# EAGLE schematic BlockBox (EAGLE 9.5.2)

## Sheet 1 of 4: Battery
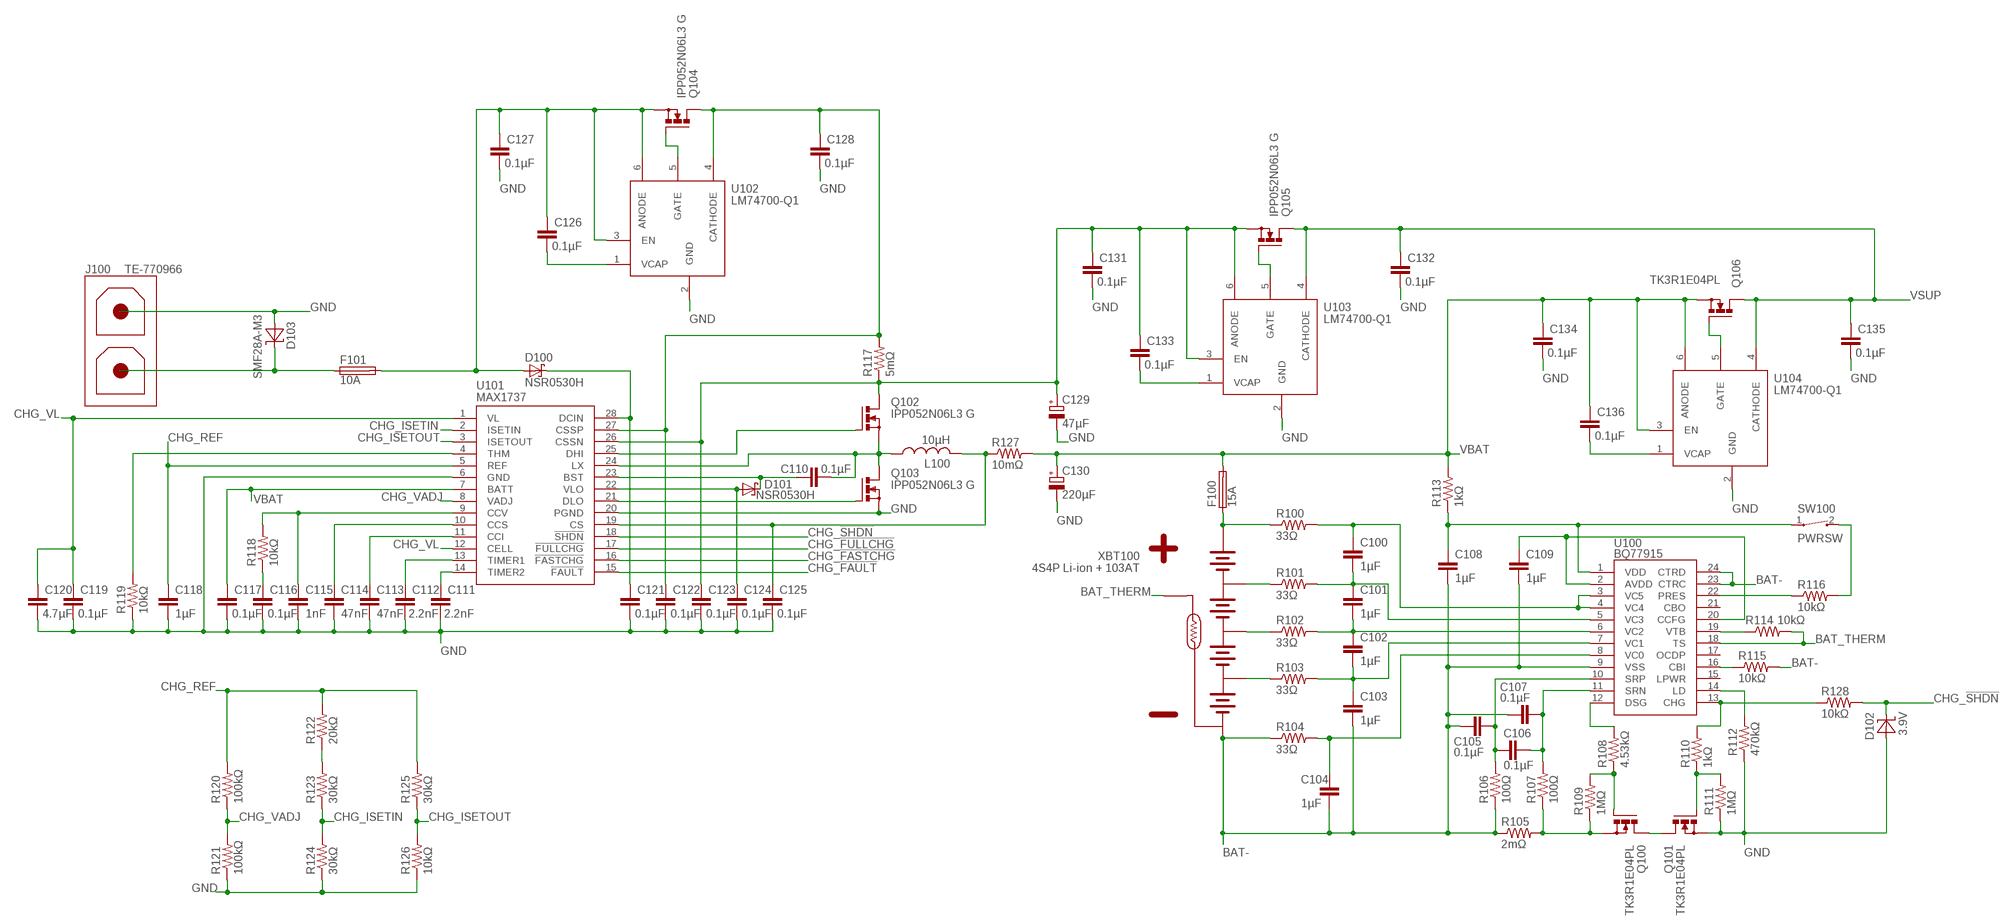
[diagram p0: schematic, sheet 1]

### Parts
C100  1µF  C-EUC0603  [C0603]
C101  1µF  C-EUC0603  [C0603]
C102  1µF  C-EUC0603  [C0603]
C103  1µF  C-EUC0603  [C0603]
C104  1µF  C-EUC0603  [C0603]
C105  0.1µF  C-EUC0805  [C0805]
C106  0.1µF  C-EUC0805  [C0805]
C107  0.1µF  C-EUC0805  [C0805]
C108  1µF  C-EUC0603  [C0603]
C109  1µF  C-EUC0603  [C0603]
C110  0.1µF  C-EUC0805  [C0805]
C111  2.2nF  C-EUC0603  [C0603]
C112  2.2nF  C-EUC0603  [C0603]
C113  47nF  C-EUC0603  [C0603]
C114  47nF  C-EUC0603  [C0603]
C115  1nF  C-EUC0603  [C0603]
C116  0.1µF  C-EUC0805  [C0805]
C117  0.1µF  C-EUC0805  [C0805]
C118  1µF  C-EUC0603  [C0603]
C119  0.1µF  C-EUC0805  [C0805]
C120  4.7µF  C-EUC0805  [C0805]
C121  0.1µF  C-EUC0805  [C0805]
C122  0.1µF  C-EUC0805  [C0805]
C123  0.1µF  C-EUC0805  [C0805]
C124  0.1µF  C-EUC0805  [C0805]
C125  0.1µF  C-EUC0805  [C0805]
C126  0.1µF  C-EUC0805  [C0805]
C127  0.1µF  C-EUC0805  [C0805]
C128  0.1µF  C-EUC0805  [C0805]
C129  47µF  CPOL-EUE2.5-6  [E2,5-6]
C130  220µF  CPOL-EUE3.5-8  [E3,5-8]
C131  0.1µF  C-EUC0805  [C0805]
C132  0.1µF  C-EUC0805  [C0805]
C133  0.1µF  C-EUC0805  [C0805]
C134  0.1µF  C-EUC0805  [C0805]
C135  0.1µF  C-EUC0805  [C0805]
C136  0.1µF  C-EUC0805  [C0805]
D100  NSR0530H  SOD323-SCHOTTKY  [SOD323]
D101  NSR0530H  SOD323-SCHOTTKY  [SOD323]
D102  3.9V  SOD323-ZENER  [SOD323]
D103  SMF28A-M3  DO-219AB-ZENER  [DO-219AB]
F100  15A  2410-FUSE  [F2410]
F101  10A  2410-FUSE  [F2410]
J100  TE-770966  [TE-770966]
L100  10µH  PM5022  [PM5022]
Q100  TK3R1E04PL  TO220BV-N-MOSFET  [TO220BV]
Q101  TK3R1E04PL  TO220BV-N-MOSFET  [TO220BV]
Q102  IPP052N06L3 G  TO220BV-N-MOSFET  [TO220BV]
Q103  IPP052N06L3 G  TO220BV-N-MOSFET  [TO220BV]
Q104  IPP052N06L3 G  TO220BV-N-MOSFET  [TO220BV]
Q105  IPP052N06L3 G  TO220BV-N-MOSFET  [TO220BV]
Q106  TK3R1E04PL  TO220BV-N-MOSFET  [TO220BV]
R100  33Ω  R-US_R0603  [R0603]
R101  33Ω  R-US_R0603  [R0603]
R102  33Ω  R-US_R0603  [R0603]
R103  33Ω  R-US_R0603  [R0603]
R104  33Ω  R-US_R0603  [R0603]
R105  2mΩ  R-US_R2512  [R2512]
R106  100Ω  R-US_R0603  [R0603]
R107  100Ω  R-US_R0603  [R0603]
R108  4.53kΩ  R-US_R0603  [R0603]
R109  1MΩ  R-US_R0603  [R0603]
R110  1kΩ  R-US_R0805  [R0805]
R111  1MΩ  R-US_R0603  [R0603]
R112  470kΩ  R-US_R0603  [R0603]
R113  1kΩ  R-US_R0805  [R0805]
R114  10kΩ  R-US_R0805  [R0805]
R115  10kΩ  R-US_R0805  [R0805]
R116  10kΩ  R-US_R0805  [R0805]
R117  5mΩ  R-US_R1206  [R1206]
R118  10kΩ  R-US_R0805  [R0805]
R119  10kΩ  R-US_R0805  [R0805]
R120  100kΩ  R-US_R0805  [R0805]
R121  100kΩ  R-US_R0805  [R0805]
R122  20kΩ  R-US_R0603  [R0603]
R123  30kΩ  R-US_R0603  [R0603]
R124  30kΩ  R-US_R0603  [R0603]
R125  30kΩ  R-US_R0603  [R0603]
R126  10kΩ  R-US_R0805  [R0805]
R127  10mΩ  R-US_R1206  [R1206]
R128  10kΩ  R-US_R0805  [R0805]
SW100  PWRSW  WIRED-SWITCH-NO  [WIRE-2P-SIMPLE]
U100  BQ77915  [TSSOP24]
U101  MAX1737  [QSOP28]
U102  LM74700-Q1  [SOT23-6L]
U103  LM74700-Q1  [SOT23-6L]
U104  LM74700-Q1  [SOT23-6L]
XBT100  4S4P Li-ion + 103AT  LI-ION-PACK-CONN  [TE-770970]

### Nets
BAT-: C103.2 C104.2 C105.1 C107.1 C108.2 C109.2 R104.1 R105.1 R106.1 R115.2 U100.9(VSS) U100.23(CTRC) U100.24(CTRD) XBT100.5(-) XBT100.6(-)
BAT-_INT1: Q100.S R105.2 R107.1 R109.1
BAT-_INT2: Q100.D Q101.D
BAT_AVDD: C109.1 U100.2(AVDD) U100.20(CCFG)
BAT_BAL0: C104.1 R104.2 U100.8(VC0)
BAT_BAL1: C102.2 C103.1 R103.2 U100.7(VC1)
BAT_BAL2: C101.2 C102.1 R102.2 U100.6(VC2)
BAT_BAL3: C100.2 C101.1 R101.2 U100.5(VC3)
BAT_BAL4: C100.1 R100.2 U100.3(VC5) U100.4(VC4)
BAT_CBI: R115.1 U100.16(CBI)
BAT_CHG_CTL: R110.2 R128.1 U100.13(CHG)
BAT_CHG_GATE: Q101.G R110.1 R111.2
BAT_CSN: C106.2 C107.2 R107.2 U100.11(SRN)
BAT_CSP: C105.2 C106.1 R106.2 U100.10(SRP)
BAT_DSG_CTL: R108.2 U100.12(DSG)
BAT_DSG_GATE: Q100.G R108.1 R109.2
BAT_INT1: R103.1 XBT100.4(BAL1)
BAT_INT2: R102.1 XBT100.3(BAL2)
BAT_INT3: R101.1 XBT100.7(BAL3)
BAT_LD: R112.2 U100.14(LD)
BAT_PRES: R116.1 U100.22(PRES)
BAT_PRES_SW: R116.2 SW100.2
BAT_THERM: R114.2 U100.18(TS) XBT100.8(THERM1)
BAT_VDD: C108.1 R113.1 SW100.1 U100.1(VDD)
BAT_VTB: R114.1 U100.19(VTB)
CHG_!FASTCHG: U101.16(!FASTCHG) ; also sheet 4
CHG_!FAULT: U101.15(!FAULT) ; also sheet 4
CHG_!FULLCHG: U101.17(!FULLCHG) ; also sheet 4
CHG_!SHDN: D102.1(C) R128.2 U101.18(!SHDN)
CHG_BST: C110.1 D101.1(C) U101.23(BST)
CHG_CCI: C113.1 U101.11(CCI)
CHG_CCS: C114.1 U101.10(CCS)
CHG_CCV: C115.1 R118.2 U101.9(CCV)
CHG_CCV_FILT: C116.1 R118.1
CHG_CS: C125.1 L100.2 R127.1 U101.19(CS)
CHG_CSSN: C123.1 C129.+ C131.1 C133.1 Q102.D Q105.S R117.1 U101.26(CSSN) U103.3(EN) U103.6(ANODE)
CHG_CSSP: C122.1 C128.1 Q104.D R117.2 U101.27(CSSP) U102.4(CATHODE)
CHG_DCIN: C121.1 D100.1(C) U101.28(DCIN)
CHG_DHI: Q102.G U101.25(DHI)
CHG_DLO: Q103.G U101.21(DLO)
CHG_ISETIN: R123.1 R124.2 U101.2(ISETIN)
CHG_ISETIN_INT: R122.1 R123.2
CHG_ISETOUT: R125.1 R126.2 U101.3(ISETOUT)
CHG_LX: C110.2 L100.1 Q102.S Q103.D U101.24(LX)
CHG_REF: C118.1 R120.2 R122.2 R125.2 U101.5(REF)
CHG_THM: R119.2 U101.4(THM)
CHG_TIMER1: C112.1 U101.13(TIMER1)
CHG_TIMER2: C111.1 U101.14(TIMER2)
CHG_VADJ: R120.1 R121.2 U101.8(VADJ)
CHG_VL: C119.1 C120.1 U101.1(VL) U101.12(CELL)
CHG_VLO: C124.1 D101.2(A) U101.22(VLO)
GND: C111.2 C112.2 C113.2 C114.2 C115.2 C116.2 C117.2 C118.2 C119.2 C120.2 C121.2 C122.2 C123.2 C124.2 C125.2 C127.2 C128.2 C129.- C130.- C131.2 C132.2 C134.2 C135.2 D102.2(A) D103.A J100.2 Q101.S Q103.S R111.1 R112.1 R119.1 R121.1 R124.1 R126.1 U101.6(GND) U101.20(PGND) U102.2(GND) U103.2(GND) U104.2(GND) ; also sheet 2,3,4
VBAT: C117.1 C130.+ C134.1 C136.1 F100.2 Q106.S R113.2 R127.2 U101.7(BATT) U104.3(EN) U104.6(ANODE) ; also sheet 4
VBAT_PREFUSE: F100.1 R100.1 XBT100.1(+) XBT100.2(+)
VIN_EXT: D103.K(C) F101.1 J100.1
VIN_EXT_FUSED: C126.1 C127.1 D100.2(A) F101.2 Q104.S U102.3(EN) U102.6(ANODE)
VIN_ID_GATE: Q104.G U102.5(GATE)
VIN_ID_VCAP: C126.2 U102.1(VCAP)
VSUP: C132.1 C135.1 Q105.D Q106.D U103.4(CATHODE) U104.4(CATHODE) ; also sheet 2
VSUP_ID1_GATE: Q105.G U103.5(GATE)
VSUP_ID1_VCAP: C133.2 U103.1(VCAP)
VSUP_ID2_GATE: Q106.G U104.5(GATE)
VSUP_ID2_VCAP: C136.2 U104.1(VCAP)
Unconnected: U100.15(LPWR) U100.17(OCDP) U100.21(CBO)

## Sheet 2 of 4: Power conversion
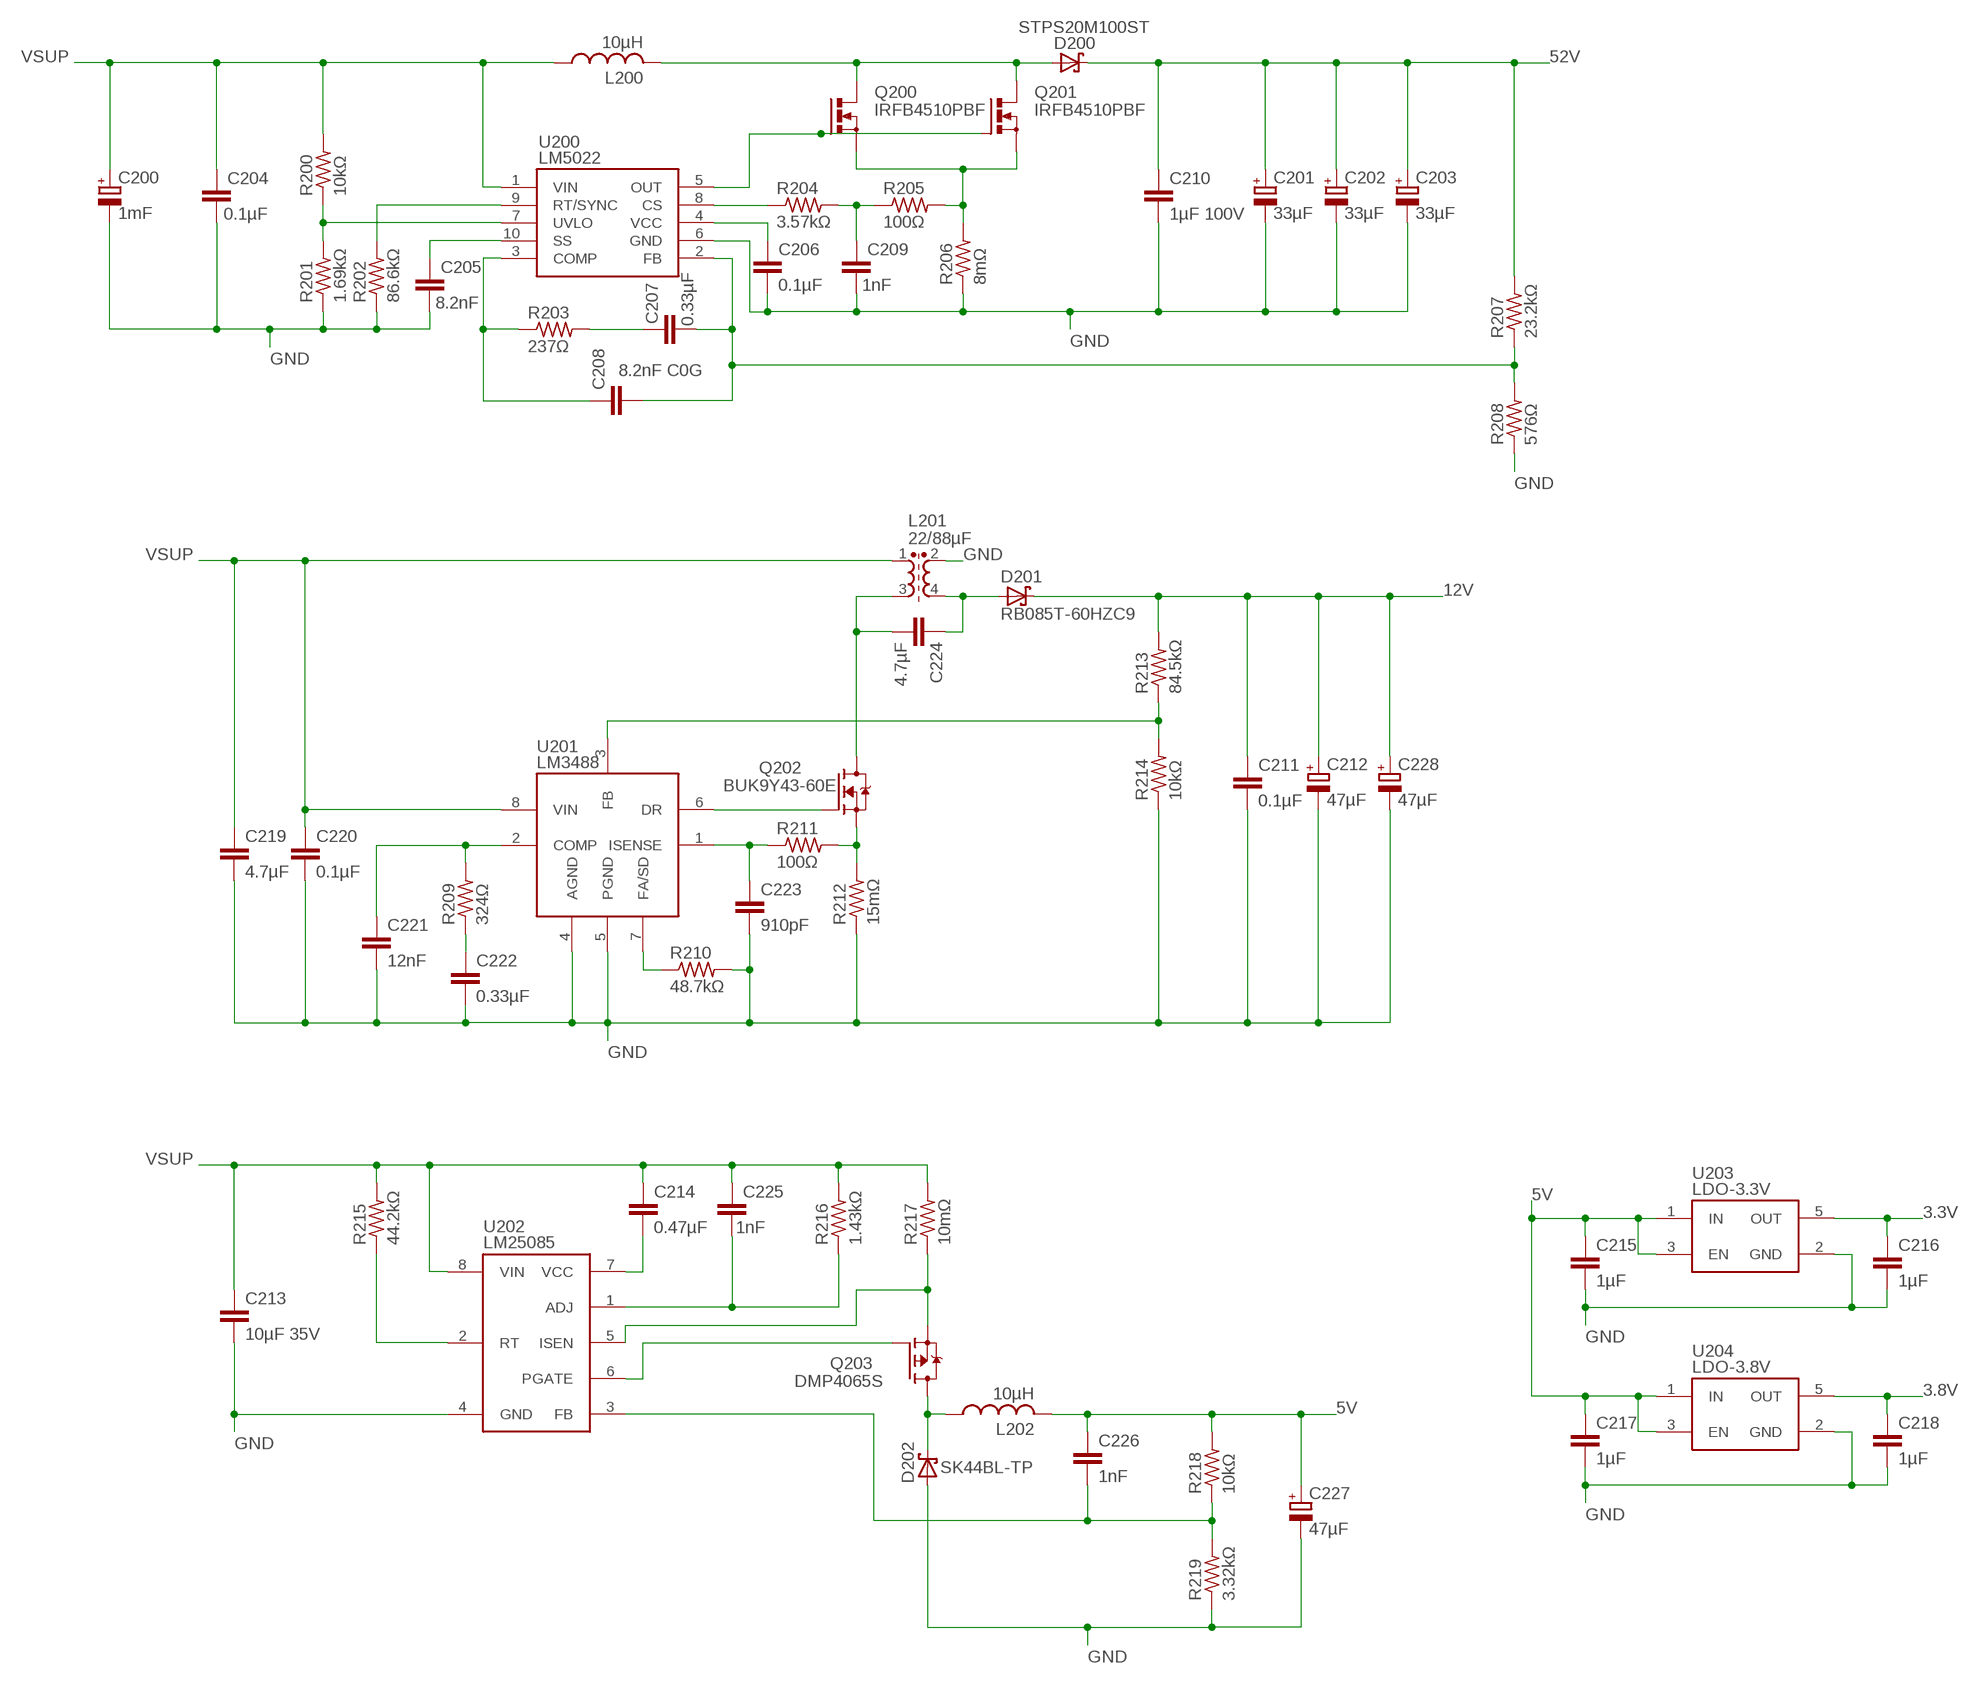
[diagram p1: schematic, sheet 2]

### Parts
C200  1mF  CPOL-EUE7.5-16  [E7,5-16]
C201  33µF  CPOL-EUE3.5-8  [E3,5-8]
C202  33µF  CPOL-EUE3.5-8  [E3,5-8]
C203  33µF  CPOL-EUE3.5-8  [E3,5-8]
C204  0.1µF  C-EUC0805  [C0805]
C205  8.2nF  C-EUC0603  [C0603]
C206  0.1µF  C-EUC0805  [C0805]
C207  0.33µF  C-EU050-035X075  [C050-035X075]
C208  8.2nF C0G  C-EUC0603  [C0603]
C209  1nF  C-EUC0603  [C0603]
C210  1µF 100V  C-EUC1206  [C1206]
C211  0.1µF  C-EUC0805  [C0805]
C212  47µF  CPOL-EUE2.5-6  [E2,5-6]
C213  10µF 35V  C-EUC1206  [C1206]
C214  0.47µF  C-EUC0603  [C0603]
C215  1µF  C-EUC0603  [C0603]
C216  1µF  C-EUC0603  [C0603]
C217  1µF  C-EUC0603  [C0603]
C218  1µF  C-EUC0603  [C0603]
C219  4.7µF  C-EUC0805  [C0805]
C220  0.1µF  C-EUC0805  [C0805]
C221  12nF  C-EUC0805  [C0805]
C222  0.33µF  C-EU050-035X075  [C050-035X075]
C223  910pF  C-EUC0603  [C0603]
C224  4.7µF  C-EUC0805  [C0805]
C225  1nF  C-EUC0603  [C0603]
C226  1nF  C-EUC0603  [C0603]
C227  47µF  CPOL-EUE2.5-6  [E2,5-6]
C228  47µF  CPOL-EUE2.5-6  [E2,5-6]
D200  STPS20M100ST  TO220AB-SCHOTTKY  [TO220ABS]
D201  RB085T-60HZC9  TO220AB-SCHOTTKY  [TO220ABS]
D202  SK44BL-TP  DO-214AA-SCHOTTKY  [DO-214AA]
L200  10µH  PQ2614B  [PQ2614B]
L201  22/88µF  SRF1280A  [SRF1280A]
L202  10µH  SRN1060  [SRN1060]
Q200  IRFB4510PBF  TO220BV-N-MOSFET  [TO220BV]
Q201  IRFB4510PBF  TO220BV-N-MOSFET  [TO220BV]
Q202  BUK9Y43-60E  SOT669-N-MOSFET  [SOT669]
Q203  DMP4065S  SOT23-P-MOSFET  [SOT23]
R200  10kΩ  R-US_R0805  [R0805]
R201  1.69kΩ  R-US_R0603  [R0603]
R202  86.6kΩ  R-US_R0603  [R0603]
R203  237Ω  R-US_R0603  [R0603]
R204  3.57kΩ  R-US_R0603  [R0603]
R205  100Ω  R-US_R0603  [R0603]
R206  8mΩ  R-US_R1206  [R1206]
R207  23.2kΩ  R-US_R0603  [R0603]
R208  576Ω  R-US_R0603  [R0603]
R209  324Ω  R-US_R0603  [R0603]
R210  48.7kΩ  R-US_R0603  [R0603]
R211  100Ω  R-US_R0603  [R0603]
R212  15mΩ  R-US_R0612  [R0612]
R213  84.5kΩ  R-US_R0603  [R0603]
R214  10kΩ  R-US_R0805  [R0805]
R215  44.2kΩ  R-US_R0603  [R0603]
R216  1.43kΩ  R-US_R0603  [R0603]
R217  10mΩ  R-US_R1206  [R1206]
R218  10kΩ  R-US_R0805  [R0805]
R219  3.32kΩ  R-US_R0603  [R0603]
U200  LM5022  [VSSOP10]
U201  LM3488  [VSSOP8]
U202  LM25085  [VSSOP8]
U203  LDO-3.3V  SOT23-5-LDO  [SOT23-5L]
U204  LDO-3.8V  SOT23-5-LDO  [SOT23-5L]

### Nets
3.3V: C216.1 U203.5(OUT) ; also sheet 3,4
3.8V: C218.1 U204.5(OUT) ; also sheet 4
5V: C215.1 C217.1 C226.1 C227.+ L202.2 R218.2 U203.1(IN) U203.3(EN) U204.1(IN) U204.3(EN) ; also sheet 4
12V: C211.1 C212.+ C228.+ D201.C R213.2 ; also sheet 3,4
52V: C201.+ C202.+ C203.+ C210.1 D200.C R207.2 ; also sheet 3
BOOST_COMP: C208.1 R203.1 U200.3(COMP)
BOOST_COMP_INT: C207.1 R203.2
BOOST_CS: R204.1 U200.8(CS)
BOOST_CS_FILTER: C209.1 R204.2 R205.1
BOOST_FB: C207.2 C208.2 R207.1 R208.2 U200.2(FB)
BOOST_RT: R202.2 U200.9(RT/SYNC)
BOOST_SS: C205.1 U200.10(SS)
BOOST_SW_DRAIN: D200.A1(A) D200.A2(A) L200.2 Q200.D Q201.D
BOOST_SW_GATE: Q200.G Q201.G U200.5(OUT)
BOOST_SW_SOURCE: Q200.S Q201.S R205.2 R206.2
BOOST_UVLO: R200.1 R201.2 U200.7(UVLO)
BOOST_VCC: C206.1 U200.4(VCC)
BUCK_ADJ: C225.2 R216.1 U202.1(ADJ)
BUCK_FB: C226.2 R218.1 R219.2 U202.3(FB)
BUCK_RT: R215.1 U202.2(RT)
BUCK_SW_DRAIN: Q203.2(S) R217.1 U202.5(ISEN)
BUCK_SW_GATE: Q203.1(G) U202.6(PGATE)
BUCK_SW_SOURCE: D202.K(C) L202.1 Q203.3(D)
BUCK_VCC: C214.2 U202.7(VCC)
GND: C200.- C201.- C202.- C203.- C204.2 C205.2 C206.2 C209.2 C210.2 C211.2 C212.- C213.2 C215.2 C216.2 C217.2 C218.2 C219.2 C220.2 C221.2 C222.2 C223.2 C227.- C228.- D202.A L201.2(S1) R201.1 R202.1 R206.1 R208.1 R210.2 R212.1 R214.1 R219.1 U200.6(GND) U201.4(AGND) U201.5(PGND) U202.4(GND) U203.2(GND) U204.2(GND) ; also sheet 1,3,4
SEPIC_COMP: C221.1 R209.2 U201.2(COMP)
SEPIC_COMP_INT: C222.1 R209.1
SEPIC_FA: R210.1 U201.7(FA/SD)
SEPIC_FB: R213.1 R214.2 U201.3(FB)
SEPIC_ISENSE: C223.1 R211.1 U201.1(ISENSE)
SEPIC_PREDIODE: C224.1 D201.A1(A) D201.A2(A) L201.4(S2)
SEPIC_SW_DRAIN: C224.2 L201.3(P2) Q202.MB(D)
SEPIC_SW_GATE: Q202.4(G) U201.6(DR)
SEPIC_SW_SOURCE: Q202.1(S) Q202.2(S) Q202.3(S) R211.2 R212.2
VSUP: C200.+ C204.1 C213.1 C214.1 C219.1 C220.1 C225.1 L200.1 L201.1 R200.2 R215.2 R216.2 R217.2 U200.1(VIN) U201.8(VIN) U202.8(VIN) ; also sheet 1

## Sheet 3 of 4: Audio path
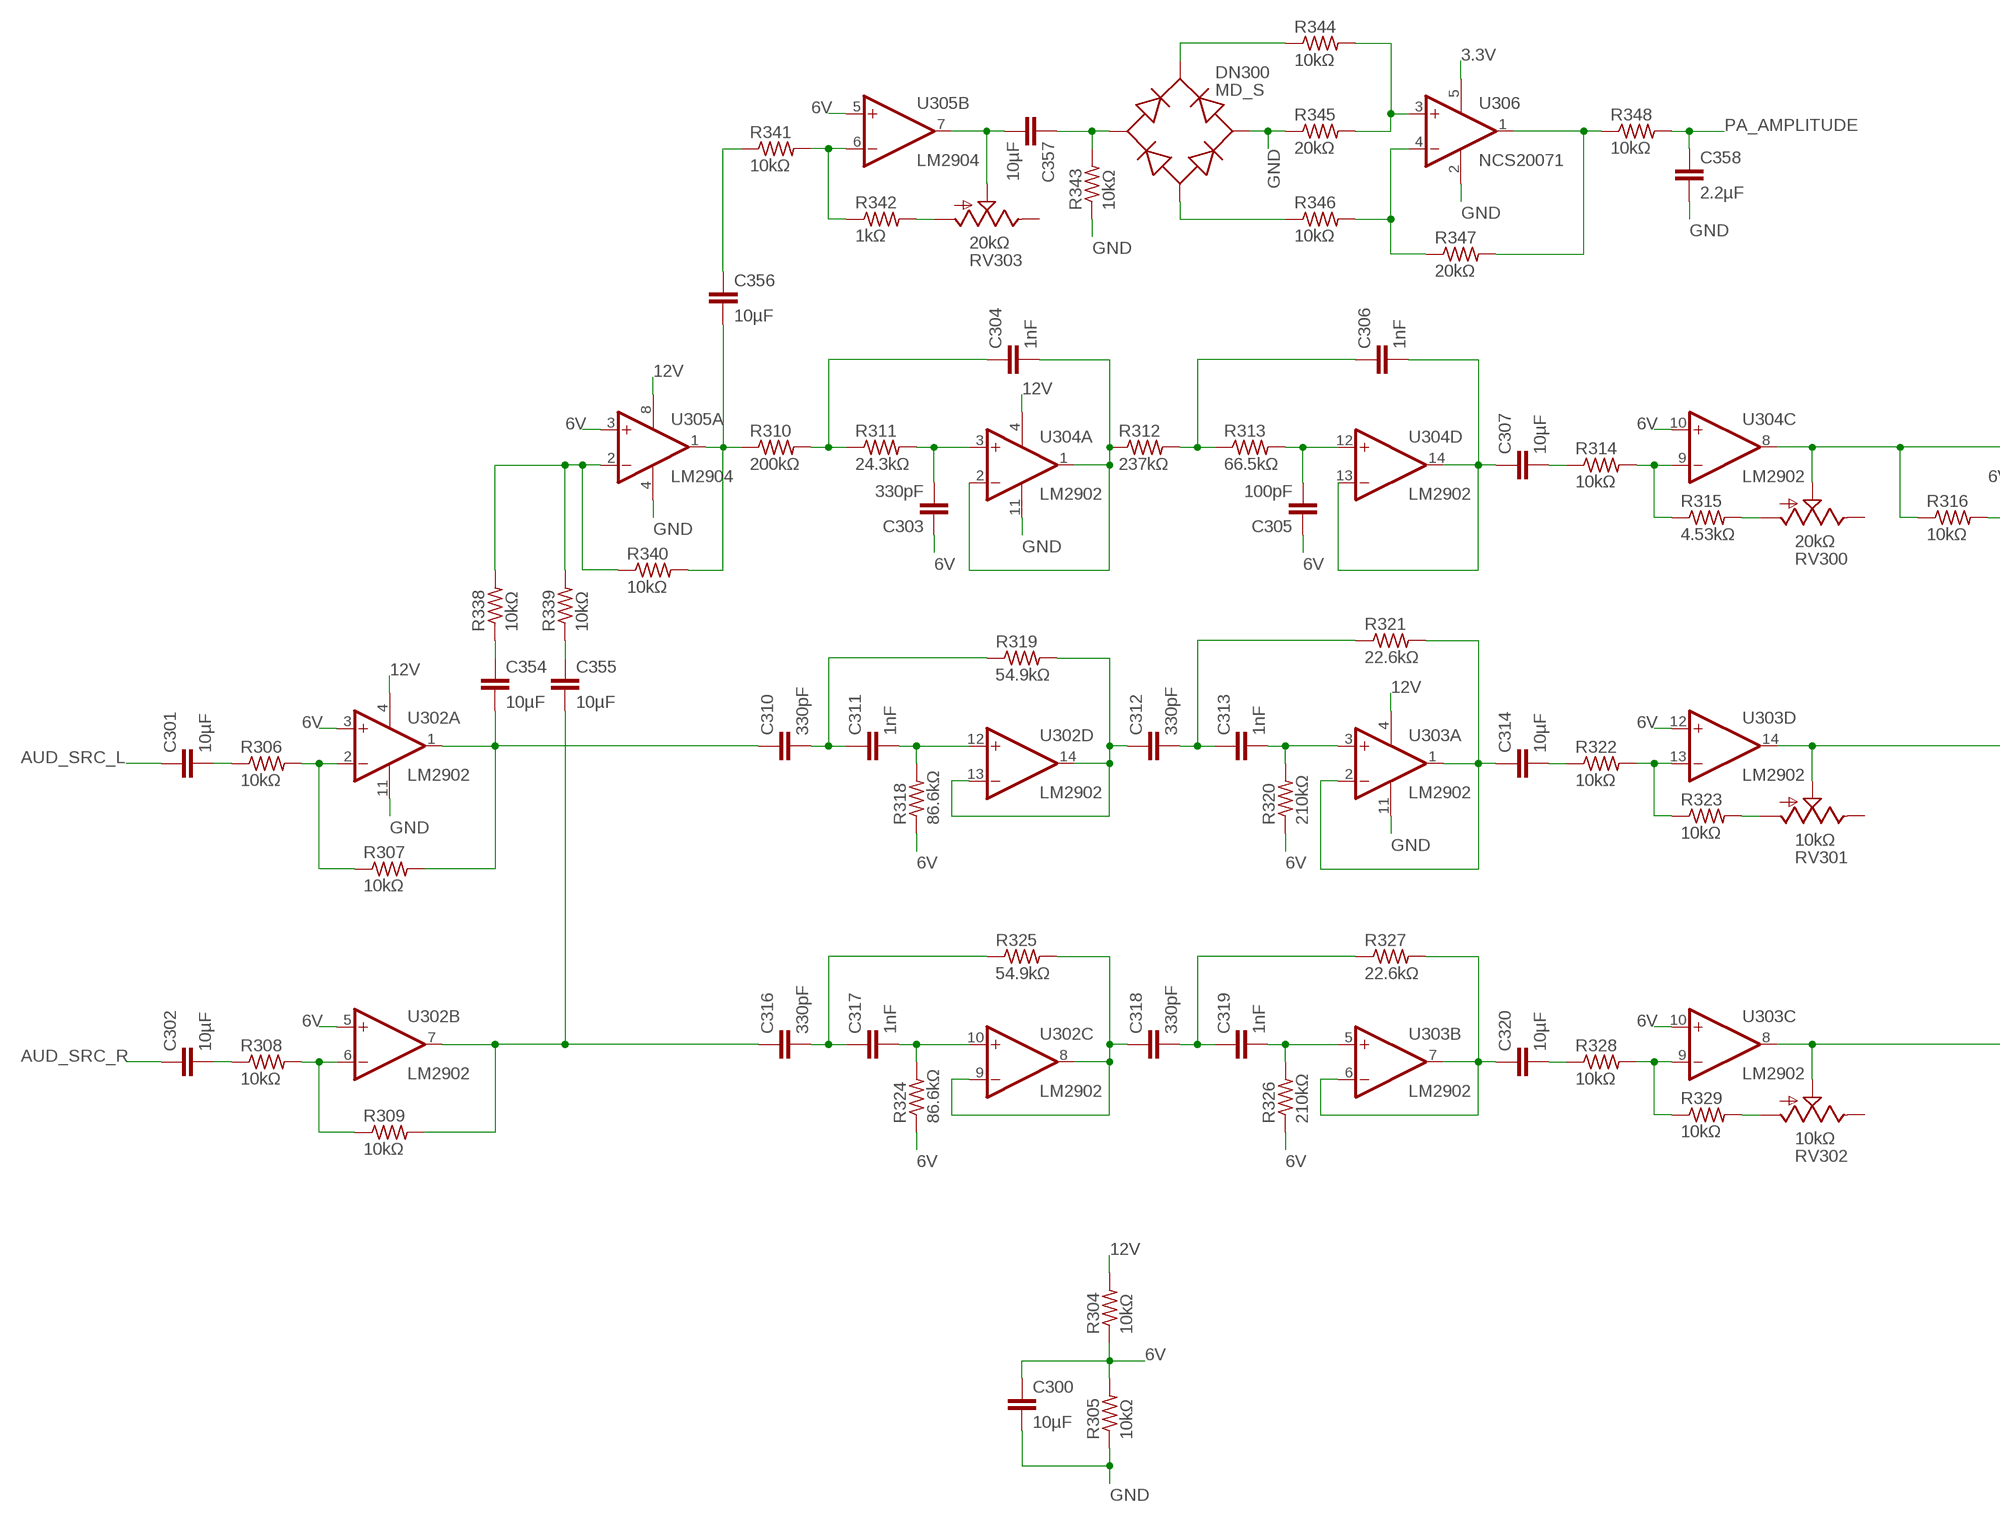
[diagram p2: schematic, sheet 3, part 1 of 2]
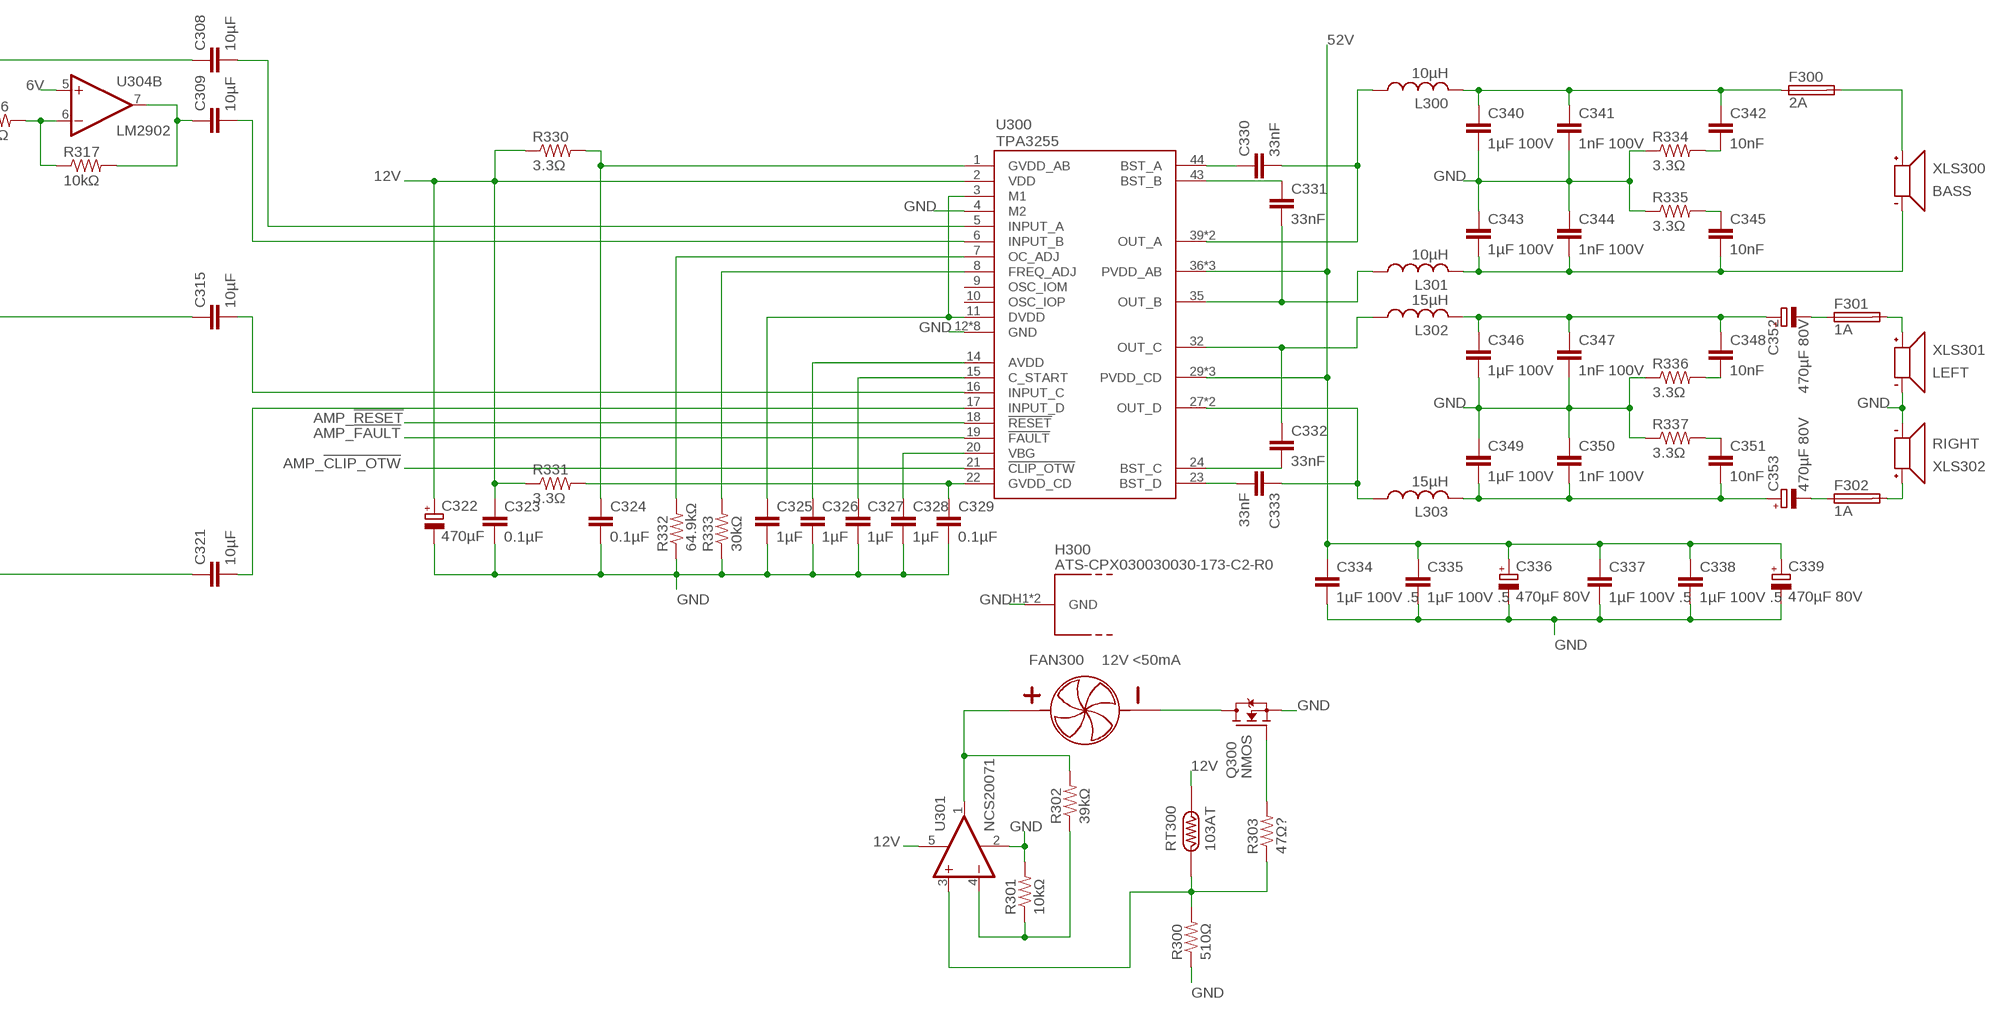
[diagram p3: schematic, sheet 3, part 2 of 2]

### Parts
C300  10µF  C-EUC0805  [C0805]
C301  10µF  C-EUC0805  [C0805]
C302  10µF  C-EUC0805  [C0805]
C303  330pF  C-EUC0603  [C0603]
C304  1nF  C-EUC0603  [C0603]
C305  100pF  C-EUC0603  [C0603]
C306  1nF  C-EUC0603  [C0603]
C307  10µF  C-EUC0805  [C0805]
C308  10µF  C-EUC0603  [C0603]
C309  10µF  C-EUC0603  [C0603]
C310  330pF  C-EUC0603  [C0603]
C311  1nF  C-EUC0603  [C0603]
C312  330pF  C-EUC0603  [C0603]
C313  1nF  C-EUC0603  [C0603]
C314  10µF  C-EUC0805  [C0805]
C315  10µF  C-EUC0603  [C0603]
C316  330pF  C-EUC0603  [C0603]
C317  1nF  C-EUC0603  [C0603]
C318  330pF  C-EUC0603  [C0603]
C319  1nF  C-EUC0603  [C0603]
C320  10µF  C-EUC0805  [C0805]
C321  10µF  C-EUC0603  [C0603]
C322  470µF  CPOL-EUE3.5-8  [E3,5-8]
C323  0.1µF  C-EUC0805  [C0805]
C324  0.1µF  C-EUC0805  [C0805]
C325  1µF  C-EUC0603  [C0603]
C326  1µF  C-EUC0603  [C0603]
C327  1µF  C-EUC0603  [C0603]
C328  1µF  C-EUC0603  [C0603]
C329  0.1µF  C-EUC0805  [C0805]
C330  33nF  C-EUC0805  [C0805]
C331  33nF  C-EUC0805  [C0805]
C332  33nF  C-EUC0805  [C0805]
C333  33nF  C-EUC0805  [C0805]
C334  1µF 100V .5  C-EUC1206  [C1206]
C335  1µF 100V .5  C-EUC1206  [C1206]
C336  470µF 80V  CPOL-EUE5-13  [E5-13]
C337  1µF 100V .5  C-EUC1206  [C1206]
C338  1µF 100V .5  C-EUC1206  [C1206]
C339  470µF 80V  CPOL-EUE5-13  [E5-13]
C340  1µF 100V  C-EUC1206  [C1206]
C341  1nF 100V  C-EUC0603  [C0603]
C342  10nF  C-EUC0603  [C0603]
C343  1µF 100V  C-EUC1206  [C1206]
C344  1nF 100V  C-EUC0603  [C0603]
C345  10nF  C-EUC0603  [C0603]
C346  1µF 100V  C-EUC1206  [C1206]
C347  1nF 100V  C-EUC0603  [C0603]
C348  10nF  C-EUC0603  [C0603]
C349  1µF 100V  C-EUC1206  [C1206]
C350  1nF 100V  C-EUC0603  [C0603]
C351  10nF  C-EUC0603  [C0603]
C352  470µF 80V  CPOL-EUE5-13  [E5-13]
C353  470µF 80V  CPOL-EUE5-13  [E5-13]
C354  10µF  C-EUC0805  [C0805]
C355  10µF  C-EUC0805  [C0805]
C356  10µF  C-EUC0805  [C0805]
C357  10µF  C-EUC0805  [C0805]
C358  2.2µF  C-EUC0603  [C0603]
DN300  MD_S  [MD-S-4]
F300  2A  MRF_FUSE  [MRF_FUSE]
F301  1A  MRF_FUSE  [MRF_FUSE]
F302  1A  MRF_FUSE  [MRF_FUSE]
FAN300  12V <50mA  WIRED-FAN  [WIRE-2P-SIMPLE]
H300  ATS-CPX030030030-173-C2-R0  [ATS-CPX030030030-173-C2-R0]
L300  10µH  RCH8011  [RCH8011]
L301  10µH  RCH8011  [RCH8011]
L302  15µH  RCH8011  [RCH8011]
L303  15µH  RCH8011  [RCH8011]
Q300  NMOS  SOT23-N-MOSFET  [SOT23]
R300  510Ω  R-US_R0603  [R0603]
R301  10kΩ  R-US_R0805  [R0805]
R302  39kΩ  R-US_R0603  [R0603]
R303  47Ω?  R-US_R0603  [R0603]
R304  10kΩ  R-US_R0805  [R0805]
R305  10kΩ  R-US_R0805  [R0805]
R306  10kΩ  R-US_R0805  [R0805]
R307  10kΩ  R-US_R0805  [R0805]
R308  10kΩ  R-US_R0805  [R0805]
R309  10kΩ  R-US_R0805  [R0805]
R310  200kΩ  R-US_R0603  [R0603]
R311  24.3kΩ  R-US_R0603  [R0603]
R312  237kΩ  R-US_R0603  [R0603]
R313  66.5kΩ  R-US_R0603  [R0603]
R314  10kΩ  R-US_R0805  [R0805]
R315  4.53kΩ  R-US_R0603  [R0603]
R316  10kΩ  R-US_R0805  [R0805]
R317  10kΩ  R-US_R0805  [R0805]
R318  86.6kΩ  R-US_R0603  [R0603]
R319  54.9kΩ  R-US_R0603  [R0603]
R320  210kΩ  R-US_R0603  [R0603]
R321  22.6kΩ  R-US_R0603  [R0603]
R322  10kΩ  R-US_R0805  [R0805]
R323  10kΩ  R-US_R0805  [R0805]
R324  86.6kΩ  R-US_R0603  [R0603]
R325  54.9kΩ  R-US_R0603  [R0603]
R326  210kΩ  R-US_R0603  [R0603]
R327  22.6kΩ  R-US_R0603  [R0603]
R328  10kΩ  R-US_R0805  [R0805]
R329  10kΩ  R-US_R0805  [R0805]
R330  3.3Ω  R-US_R0805  [R0805]
R331  3.3Ω  R-US_R0805  [R0805]
R332  64.9kΩ  R-US_R0603  [R0603]
R333  30kΩ  R-US_R0603  [R0603]
R334  3.3Ω  R-US_R0805  [R0805]
R335  3.3Ω  R-US_R0805  [R0805]
R336  3.3Ω  R-US_R0805  [R0805]
R337  3.3Ω  R-US_R0805  [R0805]
R338  10kΩ  R-US_R0805  [R0805]
R339  10kΩ  R-US_R0805  [R0805]
R340  10kΩ  R-US_R0805  [R0805]
R341  10kΩ  R-US_R0805  [R0805]
R342  1kΩ  R-US_R0805  [R0805]
R343  10kΩ  R-US_R0805  [R0805]
R344  10kΩ  R-US_R0805  [R0805]
R345  20kΩ  R-US_R0603  [R0603]
R346  10kΩ  R-US_R0805  [R0805]
R347  20kΩ  R-US_R0603  [R0603]
R348  10kΩ  R-US_R0805  [R0805]
RT300  103AT  WIRED-THERMISTOR  [WIRE-2P-SIMPLE]
RV300  20kΩ  TC33X-2  [TC33X-2]
RV301  10kΩ  TC33X-2  [TC33X-2]
RV302  10kΩ  TC33X-2  [TC33X-2]
RV303  20kΩ  TC33X-2  [TC33X-2]
U300  TPA3255  [TSSOP44]
U301  NCS20071  [TSOP-5]
U302  LM2902  [TSSOP14]
U303  LM2902  [TSSOP14]
U304  LM2902  [TSSOP14]
U305  LM2904  [MSOP8]
U306  NCS20071  [TSOP-5]
XLS300  BASS  SPEAKER-CONN  [TE-770966]
XLS301  LEFT  SPEAKER-CONN  [TE-770966]
XLS302  RIGHT  SPEAKER-CONN  [TE-770966]

### Nets
3.3V: U306.5(V+) ; also sheet 2,4
6V: C300.1 C303.1 C305.1 R304.1 R305.2 R318.1 R320.1 R324.1 R326.1 U302.3(A:+IN) U302.5(B:+IN) U303.10(C:+IN) U303.12(D:+IN) U304.5(B:+IN) U304.10(C:+IN) U305.3(A:+IN) U305.5(B:+IN)
12V: C322.+ C323.1 R304.2 R330.1 R331.1 RT300.1 U300.2(VDD) U301.5(V+) U302.4(A:V+) U303.4(A:V+) U304.4(A:V+) U305.8(A:V+) ; also sheet 2,4
52V: C334.1 C335.1 C336.+ C337.1 C338.1 C339.+ U300.29(PVDD_CD) U300.30(PVDD_CD) U300.31(PVDD_CD) U300.36(PVDD_AB) U300.37(PVDD_AB) U300.38(PVDD_AB) ; also sheet 2
AMP_!CLIP_OTW: U300.21(!CLIP_OTW) ; also sheet 4
AMP_!FAULT: U300.19(!FAULT) ; also sheet 4
AMP_!RESET: U300.18(!RESET) ; also sheet 4
AMP_A_FILT: C340.1 C341.1 C342.1 F300.1 L300.2
AMP_A_FILT_INT: C342.2 R334.2
AMP_A_FUSED: F300.2 XLS300.2(+)
AMP_AVDD: C326.1 U300.14(AVDD)
AMP_B_FILT: C343.2 C344.2 C345.2 L301.2 XLS300.1(-)
AMP_B_FILT_INT: C345.1 R335.2
AMP_BST_A: C330.1 U300.44(BST_A)
AMP_BST_B: C331.1 U300.43(BST_B)
AMP_BST_C: C332.2 U300.24(BST_C)
AMP_BST_D: C333.2 U300.23(BST_D)
AMP_C_COUPLED: C352.- F301.1
AMP_C_FILT: C346.1 C347.1 C348.1 C352.+ L302.2
AMP_C_FILT_INT: C348.2 R336.2
AMP_C_FUSED: F301.2 XLS301.2(+)
AMP_CSTART: C327.1 U300.15(C_START)
AMP_D_COUPLED: C353.- F302.1
AMP_D_FILT: C349.2 C350.2 C351.2 C353.+ L303.2
AMP_D_FILT_INT: C351.1 R337.2
AMP_D_FUSED: F302.2 XLS302.2(+)
AMP_DVDD: C325.1 U300.3(M1) U300.11(DVDD)
AMP_FAN_+: FAN300.1(+) R302.2 U301.1(OUT)
AMP_FAN_-: FAN300.2(-) Q300.3(D)
AMP_FAN_FB: R301.1 R302.1 U301.4(-IN)
AMP_FAN_GATE: Q300.1(G) R303.2
AMP_FAN_SENSE: R300.2 R303.1 RT300.2 U301.3(+IN)
AMP_FREQ_ADJ: R333.2 U300.8(FREQ_ADJ)
AMP_GVDD_AB: C324.1 R330.2 U300.1(GVDD_AB)
AMP_GVDD_CD: C329.1 R331.2 U300.22(GVDD_CD)
AMP_IN_A: C308.2 U300.5(INPUT_A)
AMP_IN_B: C309.2 U300.6(INPUT_B)
AMP_IN_C: C315.2 U300.16(INPUT_C)
AMP_IN_D: C321.2 U300.17(INPUT_D)
AMP_OC_ADJ: R332.2 U300.7(OC_ADJ)
AMP_OUT_A: C330.2 L300.1 U300.39(OUT_A) U300.40(OUT_A)
AMP_OUT_B: C331.2 L301.1 U300.35(OUT_B)
AMP_OUT_C: C332.1 L302.1 U300.32(OUT_C)
AMP_OUT_D: C333.1 L303.1 U300.27(OUT_D) U300.28(OUT_D)
AMP_VBG: C328.1 U300.20(VBG)
AUD_SRC_L: C301.1 ; also sheet 4
AUD_SRC_R: C302.1 ; also sheet 4
GND: C300.2 C322.- C323.2 C324.2 C325.2 C326.2 C327.2 C328.2 C329.2 C334.2 C335.2 C336.- C337.2 C338.2 C339.- C340.2 C341.2 C343.1 C344.1 C346.2 C347.2 C349.1 C350.1 C358.2 DN300.~2(AC2) H300.H1(GND) H300.H2(GND) Q300.2(S) R300.1 R301.2 R305.1 R332.1 R333.1 R334.1 R335.1 R336.1 R337.1 R343.1 R345.1 U300.4(M2) U300.12(GND) U300.13(GND) U300.25(GND) U300.26(GND) U300.33(GND) U300.34(GND) U300.41(GND) U300.42(GND) U301.2(V-) U302.11(A:V-) U303.11(A:V-) U304.11(A:V-) U305.4(A:V-) U306.2(V-) XLS301.1(-) XLS302.1(-) ; also sheet 1,2,4
PA_AF_DIFF+: R344.2 R345.2 U306.3(+IN)
PA_AF_DIFF-: R346.2 R347.1 U306.4(-IN)
PA_AF_FB: R341.2 R342.1 U305.6(B:-IN)
PA_AF_FB_VAR: R342.2 RV303.1(A)
PA_AF_IN: C356.1 R341.1
PA_AF_INT: C357.2 RV303.2(S) U305.7(B:OUT)
PA_AF_INT_COUPLED: C357.1 DN300.~1(AC1) R343.2
PA_AF_OUT: R347.2 R348.1 U306.1(OUT)
PA_AF_RECT+: DN300.+(DC+) R344.1
PA_AF_RECT-: DN300.-(DC-) R346.1
PA_AMPLITUDE: C358.1 R348.2 ; also sheet 4
PA_B1_FB: C304.1 R310.2 R311.1
PA_B1_FILT: C303.2 R311.2 U304.3(A:+IN)
PA_B1_OUT: C304.2 R312.1 U304.1(A:OUT) U304.2(A:-IN)
PA_B2_FB: C306.1 R312.2 R313.1
PA_B2_FILT: C305.2 R313.2 U304.12(D:+IN)
PA_B2_OUT: C306.2 C307.1 U304.13(D:-IN) U304.14(D:OUT)
PA_B_COUPLE: C307.2 R314.1
PA_B_FINAL+: C308.1 R316.1 RV300.2(S) U304.8(C:OUT)
PA_B_FINAL-: C309.1 R317.2 U304.7(B:OUT)
PA_B_GFB: R314.2 R315.1 U304.9(C:-IN)
PA_B_GFB_VAR: R315.2 RV300.1(A)
PA_B_IFB: R316.2 R317.1 U304.6(B:-IN)
PA_B_IN_BUFFERED: C356.2 R310.1 R340.2 U305.1(A:OUT)
PA_B_IN_SUM: R338.2 R339.2 R340.1 U305.2(A:-IN)
PA_BL_COUPLE: C354.1 R338.1
PA_BR_COUPLE: C355.1 R339.1
PA_L1_FB: C310.2 C311.1 R319.1
PA_L1_FILT: C311.2 R318.2 U302.12(D:+IN)
PA_L1_OUT: C312.1 R319.2 U302.13(D:-IN) U302.14(D:OUT)
PA_L2_FB: C312.2 C313.1 R321.1
PA_L2_FILT: C313.2 R320.2 U303.3(A:+IN)
PA_L2_OUT: C314.1 R321.2 U303.1(A:OUT) U303.2(A:-IN)
PA_L_COUPLE: C314.2 R322.1
PA_L_FINAL: C315.1 RV301.2(S) U303.14(D:OUT)
PA_L_GFB: R322.2 R323.1 U303.13(D:-IN)
PA_L_GFB_VAR: R323.2 RV301.1(A)
PA_L_IN_BUFFERED: C310.1 C354.2 R307.2 U302.1(A:OUT)
PA_L_IN_COUPLE: C301.2 R306.1
PA_L_IN_FB: R306.2 R307.1 U302.2(A:-IN)
PA_R1_FB: C316.2 C317.1 R325.1
PA_R1_FILT: C317.2 R324.2 U302.10(C:+IN)
PA_R1_OUT: C318.1 R325.2 U302.8(C:OUT) U302.9(C:-IN)
PA_R2_FB: C318.2 C319.1 R327.1
PA_R2_FILT: C319.2 R326.2 U303.5(B:+IN)
PA_R2_OUT: C320.1 R327.2 U303.6(B:-IN) U303.7(B:OUT)
PA_R_COUPLE: C320.2 R328.1
PA_R_FINAL: C321.1 RV302.2(S) U303.8(C:OUT)
PA_R_GFB: R328.2 R329.1 U303.9(C:-IN)
PA_R_GFB_VAR: R329.2 RV302.1(A)
PA_R_IN_BUFFERED: C316.1 C355.2 R309.2 U302.7(B:OUT)
PA_R_IN_COUPLE: C302.2 R308.1
PA_R_IN_FB: R308.2 R309.1 U302.6(B:-IN)
Unconnected: RV300.3(E) RV301.3(E) RV302.3(E) RV303.3(E) U300.9(OSC_IOM) U300.10(OSC_IOP)

## Sheet 4 of 4: Digital
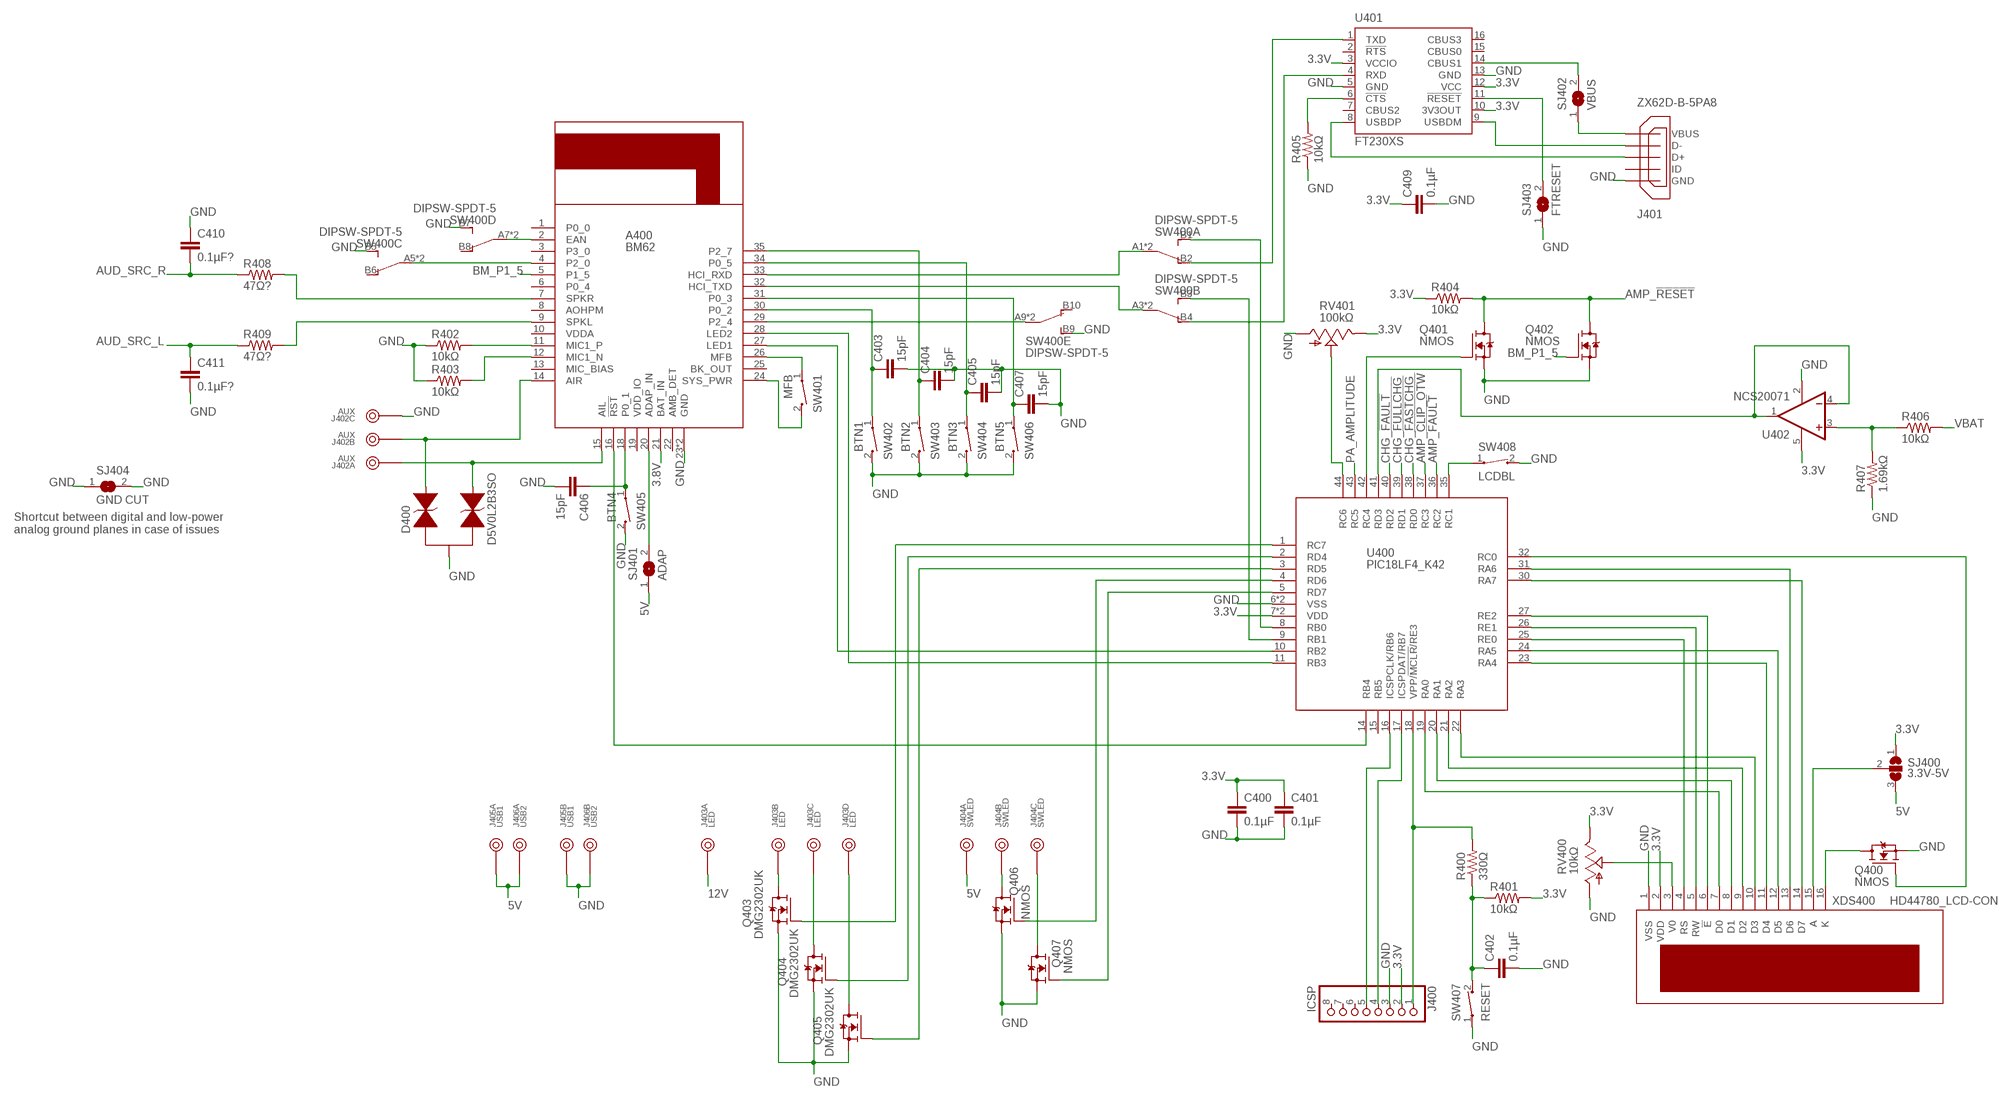
[diagram p4: schematic, sheet 4]

### Parts
A400  BM62  [BM62]
C400  0.1µF  C-EUC0805  [C0805]
C401  0.1µF  C-EUC0805  [C0805]
C402  0.1µF  C-EUC0805  [C0805]
C403  15pF  C-EUC0603  [C0603]
C404  15pF  C-EUC0603  [C0603]
C405  15pF  C-EUC0603  [C0603]
C406  15pF  C-EUC0603  [C0603]
C407  15pF  C-EUC0603  [C0603]
C409  0.1µF  C-EUC0805  [C0805]
C410  0.1µF?  C-EUC0805  [C0805]
C411  0.1µF?  C-EUC0805  [C0805]
D400  D5V0L2B3SO  SOT23-TVS  [SOT23]
J400  ICSP  PINHD-1X8  [1X08]
J401  ZX62D-B-5PA8  [ZX62D-B-5PA8]
J402  AUX  GEN-3PIN  [3PIN]
J403  LED  GEN-4PIN  [4PIN]
J404  SWLED  GEN-3PIN  [3PIN]
J405  USB1  GEN-2PIN  [2PIN]
J406  USB2  GEN-2PIN  [2PIN]
Q400  NMOS  SOT23-N-MOSFET  [SOT23]
Q401  NMOS  SOT23-N-MOSFET  [SOT23]
Q402  NMOS  SOT23-N-MOSFET  [SOT23]
Q403  DMG2302UK  SOT23-N-MOSFET  [SOT23]
Q404  DMG2302UK  SOT23-N-MOSFET  [SOT23]
Q405  DMG2302UK  SOT23-N-MOSFET  [SOT23]
Q406  NMOS  SOT23-N-MOSFET  [SOT23]
Q407  NMOS  SOT23-N-MOSFET  [SOT23]
R400  330Ω  R-US_R0805  [R0805]
R401  10kΩ  R-US_R0805  [R0805]
R402  10kΩ  R-US_R0805  [R0805]
R403  10kΩ  R-US_R0805  [R0805]
R404  10kΩ  R-US_R0805  [R0805]
R405  10kΩ  R-US_R0805  [R0805]
R406  10kΩ  R-US_R0805  [R0805]
R407  1.69kΩ  R-US_R0603  [R0603]
R408  47Ω?  R-US_R0603  [R0603]
R409  47Ω?  R-US_R0603  [R0603]
RV400  10kΩ  TC33X-2  [TC33X-2]
RV401  100kΩ  WIRED-POTENTIOMETER  [WIRE-3P-SIMPLE]
SJ400  3.3V-5V  SJ2W  [SJ_2]
SJ401  ADAP  SJ  [SJ]
SJ402  VBUS  SJ  [SJ]
SJ403  FTRESET  SJ  [SJ]
SJ404  GND CUT  SJ  [SJ]
SW400  DIPSW-SPDT-5  [DIPSW-10]
SW401  MFB  WIRED-SWITCH-NO  [WIRE-2P-SIMPLE]
SW402  BTN1  WIRED-SWITCH-NO  [WIRE-2P-SIMPLE]
SW403  BTN2  WIRED-SWITCH-NO  [WIRE-2P-SIMPLE]
SW404  BTN3  WIRED-SWITCH-NO  [WIRE-2P-SIMPLE]
SW405  BTN4  WIRED-SWITCH-NO  [WIRE-2P-SIMPLE]
SW406  BTN5  WIRED-SWITCH-NO  [WIRE-2P-SIMPLE]
SW407  RESET  WIRED-SWITCH-NO  [WIRE-2P-SIMPLE]
SW408  LCDBL  WIRED-SWITCH-NO  [WIRE-2P-SIMPLE]
U400  PIC18LF4_K42  [TQFP44]
U401  FT230XS  [SSOP16]
U402  NCS20071  [TSOP-5]
XDS400  HD44780_LCD-CON  [2X8PIN]

### Nets
3.3V: C400.1 C401.1 C409.1 J400.2 R401.2 R404.1 RV400.3(E) RV401.3(E) SJ400.1 U400.7(VDD) U400.28(VDD) U401.3(VCCIO) U401.10(3V3OUT) U401.12(VCC) U402.5(V+) XDS400.2(VDD) ; also sheet 2,3
3.8V: A400.21(BAT_IN) ; also sheet 2
5V: J404.1 J405.1 J406.1 SJ400.3 SJ401.1 ; also sheet 2
12V: J403.1 ; also sheet 2,3
AMP_!CLIP_OTW: U400.37(RC3) ; also sheet 3
AMP_!FAULT: U400.36(RC2) ; also sheet 3
AMP_!RESET: Q401.3(D) Q402.3(D) R404.2 ; also sheet 3
AUD_SRC_L: C411.1 R409.1 ; also sheet 3
AUD_SRC_R: C410.2 R408.1 ; also sheet 3
BM_!RST: A400.16(!RST) U400.14(RB4)
BM_ADAP_IN: A400.20(ADAP_IN) SJ401.2
BM_AIL: A400.15(AIL) D400.2 J402.1
BM_AIR: A400.14(AIR) D400.1 J402.2
BM_EAN: A400.2(EAN) SW400.A7(D:P) SW400.A8(D:P)
BM_HCI_RXD: A400.33(HCI_RXD) SW400.A1(A:P) SW400.A2(A:P)
BM_HCI_TXD: A400.32(HCI_TXD) SW400.A3(B:P) SW400.A4(B:P)
BM_LED1: A400.27(LED1) U400.10(RB2)
BM_LED2: A400.28(LED2) U400.11(RB3)
BM_MFB: A400.26(MFB) SW401.1
BM_MIC_N: A400.12(MIC1_N) R403.2
BM_MIC_P: A400.11(MIC1_P) R402.2
BM_P0_1: A400.18(P0_1) C406.1 SW405.1
BM_P0_2: A400.30(P0_2) C403.1 SW402.1
BM_P0_3: A400.31(P0_3) C407.1 SW406.1
BM_P0_5: A400.34(P0_5) C405.1 SW404.1
BM_P1_5: A400.5(P1_5) Q402.1(G)
BM_P2_0: A400.4(P2_0) SW400.A5(C:P) SW400.A6(C:P)
BM_P2_4: A400.29(P2_4) SW400.A9(E:P) SW400.A10(E:P)
BM_P2_7: A400.35(P2_7) C404.1 SW403.1
BM_SPKL: A400.9(SPKL) R409.2
BM_SPKR: A400.7(SPKR) R408.2
BM_SYS_PWR: A400.24(SYS_PWR) SW401.2
CHG_!FASTCHG: U400.38(RD0) ; also sheet 1
CHG_!FAULT: U400.40(RD2) ; also sheet 1
CHG_!FULLCHG: U400.39(RD1) ; also sheet 1
FT_!CTS: R405.2 U401.6(!CTS)
FT_!RESET: SJ403.2 U401.11(!RESET)
FT_RXD: SW400.B4(B:O) U401.4(RXD)
FT_TXD: SW400.B2(A:O) U401.1(TXD)
FT_VBUS_SENSE: SJ402.2 U401.14(CBUS1)
GND: A400.23(GND) A400.37(GND) C400.2 C401.2 C402.2 C403.2 C404.2 C405.2 C406.2 C407.2 C409.2 C410.1 C411.2 D400.3(C) J400.3 J401.5(GND) J401.S1(GND) J401.S2(GND) J401.S3(GND) J401.S4(GND) J402.3 J405.2 J406.2 Q400.2(S) Q401.2(S) Q402.2(S) Q403.2(S) Q404.2(S) Q405.2(S) Q406.2(S) Q407.2(S) R402.1 R403.1 R405.1 R407.1 RV400.1(A) RV401.1(A) SJ403.1 SJ404.1 SJ404.2 SW400.B5(C:S) SW400.B7(D:S) SW400.B9(E:S) SW402.2 SW403.2 SW404.2 SW405.2 SW406.2 SW407.1 SW408.2 U400.6(VSS) U400.29(VSS) U401.5(GND) U401.13(GND) U402.2(V-) XDS400.1(VSS) ; also sheet 1,2,3
LCD_!E: U400.27(RE2) XDS400.6(!E)
LCD_A: SJ400.2 XDS400.15(A)
LCD_BL_EN: Q400.1(G) U400.32(RC0)
LCD_D0: U400.19(RA0) XDS400.7(D0)
LCD_D1: U400.20(RA1) XDS400.8(D1)
LCD_D2: U400.21(RA2) XDS400.9(D2)
LCD_D3: U400.22(RA3) XDS400.10(D3)
LCD_D4: U400.23(RA4) XDS400.11(D4)
LCD_D6: U400.31(RA6) XDS400.13(D6)
LCD_D7: U400.30(RA7) XDS400.14(D7)
LCD_K: Q400.3(D) XDS400.16(K)
LCD_RS: U400.25(RE0) XDS400.4(RS)
LCD_RW: U400.26(RE1) XDS400.5(RW)
LCD_V0: RV400.2(S) XDS400.3(V0)
LDC_D5: U400.24(RA5) XDS400.12(D5)
LED_B: J403.4 Q405.3(D)
LED_G: J403.2 Q403.3(D)
LED_R: J403.3 Q404.3(D)
MCU_!MCLR: J400.1 R400.2 U400.18(VPP/!MCLR!/RE3)
MCU_!MCLR!_FILTERED: C402.1 R400.1 R401.1 SW407.2
MCU_AMP_RESET: Q401.1(G) U400.42(RC4)
MCU_BAT_SENSE: U400.41(RD3) U402.1(OUT) U402.4(-IN)
MCU_BAT_VDIV: R406.1 R407.2 U402.3(+IN)
MCU_BL_SW: SW408.1 U400.35(RC1)
MCU_ICSPCLK: J400.5 U400.16(ICSPCLK/RB6)
MCU_ICSPDAT: J400.4 U400.17(ICSPDAT/RB7)
MCU_LED_B: Q405.1(G) U400.3(RD5)
MCU_LED_G: Q403.1(G) U400.1(RC7)
MCU_LED_POT: RV401.2(S) U400.44(RC6)
MCU_LED_R: Q404.1(G) U400.2(RD4)
MCU_SWLED_MAIN: Q406.1(G) U400.4(RD6)
MCU_SWLED_PWR: Q407.1(G) U400.5(RD7)
MCU_UART_RX: SW400.B3(B:S) U400.9(RB1)
MCU_UART_TX: SW400.B1(A:S) U400.8(RB0)
PA_AMPLITUDE: U400.43(RC5) ; also sheet 3
SWLED_MAIN: J404.2 Q406.3(D)
SWLED_PWR: J404.3 Q407.3(D)
USB_D+: J401.3(D+) U401.8(USBDP)
USB_D-: J401.2(D-) U401.9(USBDM)
USB_VBUS: J401.1(VBUS) SJ402.1
VBAT: R406.2 ; also sheet 1
Unconnected: A400.1(P0_0) A400.3(P3_0) A400.6(P0_4) A400.8(AOHPM) A400.10(VDDA) A400.13(MIC_BIAS) A400.19(VDD_IO) A400.22(AMB_DET) A400.25(BK_OUT) J400.6 J400.7 J400.8 J401.4(ID) SW400.B6(C:O) SW400.B8(D:O) SW400.B10(E:O) U400.15(RB5) U401.2(!RTS) U401.7(CBUS2) U401.15(CBUS0) U401.16(CBUS3)

### Notes on the sheet
- Shortcut between digital and low-power
  analog ground planes in case of issues

## Library data of the parts
A400 = BW-Active:BM62: Bluetooth audio module
C100-C128 C131-C136 C204-C211 C213-C226 C300-C321 C323-C335 C337 C338 C340-C351 C354-C358 C400-C407 C409-C411 = rcl:C-EU: CAPACITOR, European symbol; SPICEPREFIX: C
C129 C130 C200-C203 C212 C227 C228 C322 C336 C339 C352 C353 = rcl:CPOL-EU: POLARIZED CAPACITOR, European symbol; SPICEPREFIX: C
D100 D101 = BW-Active:SOD323-SCHOTTKY
D102 = BW-Active:SOD323-ZENER
D103 = BW-Active:DO-219AB-ZENER
D200 D201 = BW-Active:TO220AB-SCHOTTKY
D202 = BW-Active:DO-214AA-SCHOTTKY
D400 = BW-Active:SOT23-TVS
DN300 = BW-Active:MD_S: 1A full bridge rectifier
F100 F101 = BW-PassiveMechanical:2410-FUSE
F300-F302 = BW-PassiveMechanical:MRF_FUSE
FAN300 = BW-PassiveMechanical:WIRED-FAN: Simple 2-pin fan with wire/header connections
H300 = BW-PassiveMechanical:ATS-CPX030030030-173-C2-R0: Heatsink 30x30x30mm
J100 = BW-Connectors:TE-770966: 2-pin locking connector, right-angle
J400 = BW-Connectors:PINHD-1X8: 1x8 pin header
J401 = BW-Connectors:ZX62D-B-5PA8: Micro-USB connector, bottom mount
J402 J404 = BW-Connectors:GEN-3PIN
J403 = BW-Connectors:GEN-4PIN
J405 J406 = BW-Connectors:GEN-2PIN
L100 = BW-PassiveMechanical:PM5022: Med-high current inductor
L200 = BW-PassiveMechanical:PQ2614B: High current inductor
L201 = BW-PassiveMechanical:SRF1280A: Medium current coupled inductor
L202 = BW-PassiveMechanical:SRN1060: Medium current inductor
L300-L303 = BW-PassiveMechanical:RCH8011: Low-med current inductor
Q100-Q106 Q200 Q201 = BW-Active:TO220BV-N-MOSFET
Q202 = BW-Active:SOT669-N-MOSFET
Q203 = BW-Active:SOT23-P-MOSFET
Q300 Q400-Q407 = BW-Active:SOT23-N-MOSFET
R100-R128 R200-R211 R213-R219 R300-R348 R400-R409 = resistor:R-US_: RESISTOR, American symbol
R212 = BW-PassiveMechanical:R-US_R0612
RT300 = BW-PassiveMechanical:WIRED-THERMISTOR: Thermistor with wire/header connections
RV300-RV303 RV400 = BW-PassiveMechanical:TC33X-2: 3mm SMD trimmer potentiometer
RV401 = BW-PassiveMechanical:WIRED-POTENTIOMETER: Potentiometer with wire/header connections
SJ400 = jumper:SJ2W: SMD solder JUMPER
SJ401-SJ404 = jumper:SJ: SMD solder JUMPER
SW100 SW401-SW408 = BW-PassiveMechanical:WIRED-SWITCH-NO: Normally open switch with wire/header connections
SW400 = BW-PassiveMechanical:DIPSW-SPDT-5: 5x SPDT DIP switches
U100 = BW-Active:BQ77915: 3-5s Lithium battery protection & management
U101 = BW-Active:MAX1737: 1-4s lithium battery charge controller
U102-U104 = BW-Active:LM74700-Q1: Ideal diode controller
U200 = BW-Active:LM5022: Boost controller
U201 = BW-Active:LM3488: Boost/SEPIC/Flyback switching controller
U202 = BW-Active:LM25085: Buck controller
U203 U204 = BW-Active:SOT23-5-LDO
U300 = BW-Active:TPA3255: Class D audio amplifier up to 600W into PBTL Mono
U301 U306 U402 = BW-Active:NCS20071: Single-channel medium-power OpAmp
U302-U304 = BW-Active:LM2902: Quad OpAmp
U305 = BW-Active:LM2904: Dual OpAmp
U400 = BW-Active:PIC18*4_K42: 8-bit 64MHz microcontroller, 44-pin
U401 = ftdichip:FT230X: USB to BASIC UART IC Auto generated by make-symbol-device-package-bsdl.ulp Rev. 43 Source: Data sheet <http://www.ftdichip.com/Support/Documents/DataSheets/ICs/DS_FT230X.pdf>
XBT100 = BW-Connectors:LI-ION-PACK-CONN: 4s Li-Ion battery pack connector with integrated thermistor
XDS400 = BW-Active:HD44780_LCD: Character LCD based on HD44780 chip
XLS300-XLS302 = BW-Connectors:SPEAKER-CONN